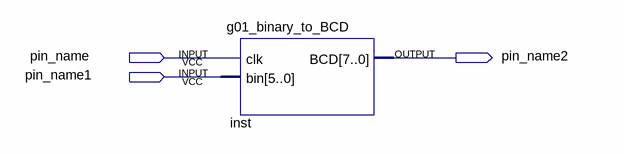
[diagram p0: schematic sheet]
// Quartus schematic Lab2.bdf as structural Verilog: 1 symbols, 3 pins
module Lab2 (
  input  pin_name,
  input  pin_name1,
  output pin_name2
);

  g01_binary_to_BCD inst (.clk(pin_name), .bin({6{pin_name1}}), .BCD(pin_name2));
endmodule
